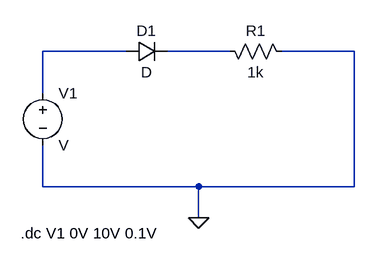
[diagram p0: schematic Experiment 1.asc]
Experiment 1.asc, the LTspice schematic file:
Version 4
SHEET 1 880 680
WIRE 64 64 -64 64
WIRE 224 64 128 64
WIRE 416 64 304 64
WIRE -64 128 -64 64
WIRE -64 272 -64 208
WIRE 176 272 -64 272
WIRE 416 272 416 64
WIRE 416 272 176 272
WIRE 176 320 176 272
FLAG 176 320 0
SYMBOL voltage -64 112 R0
SYMATTR InstName V1
SYMBOL diode 64 80 R270
WINDOW 0 32 32 VTop 2
WINDOW 3 0 32 VBottom 2
SYMATTR InstName D1
SYMBOL res 208 48 M90
WINDOW 0 0 56 VBottom 2
WINDOW 3 32 56 VTop 2
SYMATTR InstName R1
SYMATTR Value 1k
TEXT -98 344 Left 2 !.dc V1 0V 10V 0.1V

The netlist it stands for:
* Experiment 1.asc
V1 N001 0 V
D1 N001 N002 D
R1 N002 0 1k
.model D D
.lib standard.dio
.dc V1 0V 10V 0.1V
.backanno
.end